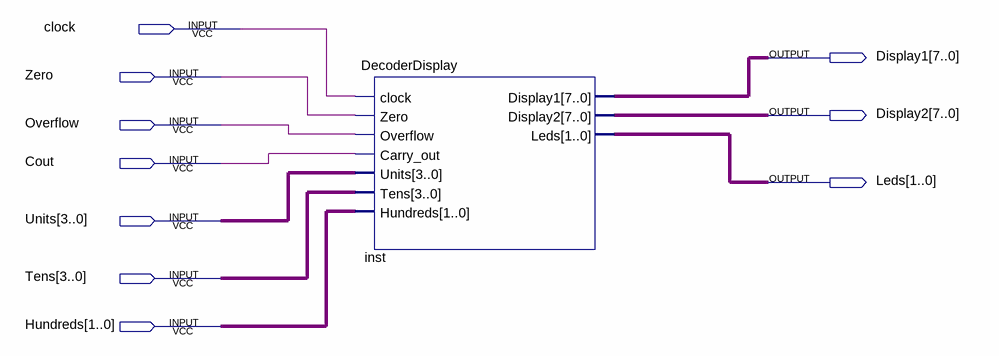
[diagram p0: schematic sheet]
// Quartus schematic TestDecoderDisplay.bdf as structural Verilog: 1 symbols, 10 pins
module TestDecoderDisplay (
  input  clock,
  input  Zero,
  input  Overflow,
  input  Cout,
  input  [3:0] Units,
  input  [3:0] Tens,
  input  [1:0] Hundreds,
  output [7:0] Display1,
  output [7:0] Display2,
  output [1:0] Leds
);

  DecoderDisplay inst (
    .clock(clock), .Zero(Zero), .Overflow(Overflow), .Carry_out(Cout), .Units(Units), .Tens(Tens),
    .Hundreds(Hundreds), .Display1(Display1), .Display2(Display2), .Leds(Leds));
endmodule
